# Altium schematic sheet CATS-FAT-USB.SchDoc: CATS Pro
size A4; Author: Luca Jost; Revision: 1.0; SheetNumber: 6; SheetTotal: 13; Subtitle: USB
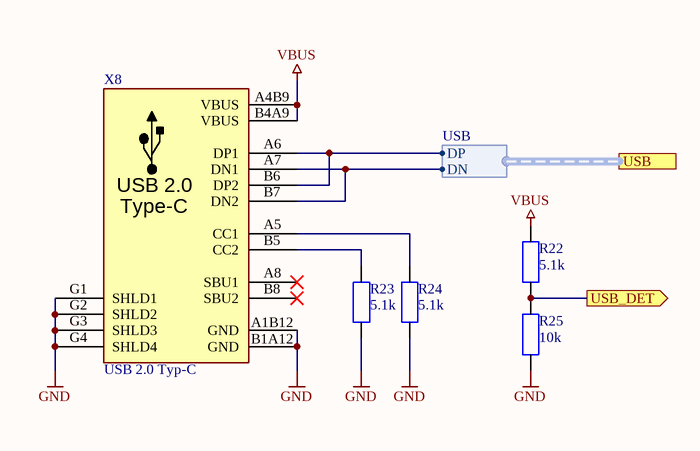
[diagram p0: CATS-FAT-USB.SchDoc]

## Parts
R22  5.1k  [SMD Widerstand 0603]
R23  5.1k  [SMD Widerstand 0603]
R24  5.1k  [SMD Widerstand 0603]
R25  10k  [SMD Widerstand 0603]
X8  USB 2.0 Typ-C  [THT USB-C Socket (A40-00119)]

## Ports
USB (harness USB), USB_DET (out)

## Harnesses
USB: DP, DN

## Nets
GND: R23.1 R24.1 R25.2 X8.A1B12(GND) X8.B1A12(GND) X8.G1(SHLD1) X8.G2(SHLD2) X8.G3(SHLD3) X8.G4(SHLD4)
VBUS: R22.1 X8.A4B9(VBUS) X8.B4A9(VBUS)
USB_DET: R22.2 R25.1 ; port USB_DET
NetR23_2: R23.2 X8.B5(CC2)
NetR24_2: R24.2 X8.A5(CC1)
NetX8_A6: X8.A6(DP1) X8.B6(DP2) ; port USB.DP
NetX8_A7: X8.A7(DN1) X8.B7(DN2) ; port USB.DN

Not connected (* = marked no-connect by the designer): X8 A8(SBU1)* B8(SBU2)*

## Notes on the sheet
- Title
- Author:
- Subtitle
- Date:
- Rev:
- CATS
- Sheet
- of
- File:
- (in symbol USB Type-C USB 2.0) USB 2.0; Type-C

## Library data of the parts
R22-R24 = E24 - 5.1k: SMD Chip Resistor E24; Unit Price: 0.01; Number: -; Supplier: -
R25 = E24 - 10k: SMD Chip Resistor E24; Unit Price: 0.01; Number: -; Supplier: -
X8 = USB Type-C USB 2.0: Typ-C; aliExpress: 33045191307; Digikey: 2073-USB4105-GF-ACT-ND; Farnell: 3583366